# Altium schematic sheet Mainboard_LoRa   VCC  SCH.SchDoc
size A4
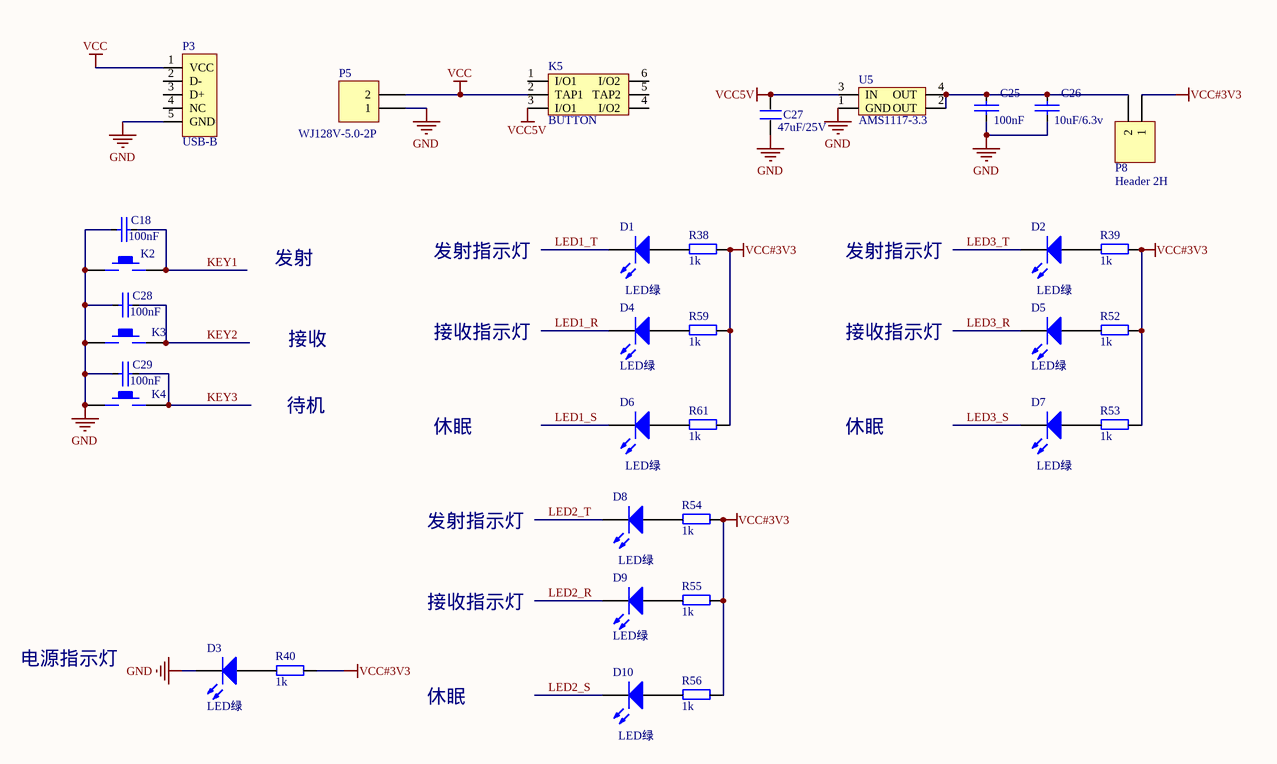
[diagram p0: Mainboard_LoRa   VCC  SCH.SchDoc]

## Parts
C18  100nF  [CAPC_0603_2]
C25  100nF  [CAPC_0603_2]
C26  10uF/6.3v  [CAPC_0603_2]
C27  47uF/25V  [CAPE_D]
C28  100nF  [CAPC_0603_2]
C29  100nF  [CAPC_0603_2]
D1  LED绿  [LED_0805_G]
D2  LED绿  [LED_0805_G]
D3  LED绿  [LED_0805_G]
D4  LED绿  [LED_0805_G]
D5  LED绿  [LED_0805_G]
D6  LED绿  [LED_0805_G]
D7  LED绿  [LED_0805_G]
D8  LED绿  [LED_0805_G]
D9  LED绿  [LED_0805_G]
D10  LED绿  [LED_0805_G]
K2  K2-1102SP-E4SC-04  [SW_PB_SMD_6X6]  (value not drawn)
K3  K2-1102SP-E4SC-04  [SW_PB_SMD_6X6]  (value not drawn)
K4  K2-1102SP-E4SC-04  [SW_PB_SMD_6X6]  (value not drawn)
K5  BUTTON  [KFT DIP-8X8]
P3  USB-B  [USB_Micro_DIP41]
P5  WJ128V-5.0-2P  [KF128_2P]
P8  Header 2H  [Header 2.54X2]
R38  1k  [RESC_0603_2]
R39  1k  [RESC_0603_2]
R40  1k  [RESC_0603_2]
R52  1k  [RESC_0603_2]
R53  1k  [RESC_0603_2]
R54  1k  [RESC_0603_2]
R55  1k  [RESC_0603_2]
R56  1k  [RESC_0603_2]
R59  1k  [RESC_0603_2]
R61  1k  [RESC_0603_2]
U5  AMS1117-3.3  [SOT223_3]

## Nets
GND: C18.1 C25.1 C26.1 C27.1 C28.1 C29.1 D3.2(K) K2.1 K3.1 K4.1 P3.5(GND) P5.1 U5.1(GND)
VCC: K5.2(TAP1) P3.1(VCC) P5.2
VCC5V: C27.2 K5.3(I/O1) U5.3(IN)
VCC#3V3: P8.1 R38.1 R39.1 R40.1 R52.1 R53.1 R54.1 R55.1 R56.1 R59.1 R61.1
KEY1: C18.2 K2.2
KEY2: C28.2 K3.2
KEY3: C29.2 K4.2
LED1_R: D4.2(K)
LED1_S: D6.2(K)
LED1_T: D1.2(K)
LED2_R: D9.2(K)
LED2_S: D10.2(K)
LED2_T: D8.2(K)
LED3_R: D5.2(K)
LED3_S: D7.2(K)
LED3_T: D2.2(K)
NetC25_2: C25.2 C26.2 P8.2 U5.2(OUT) U5.4(OUT)
NetD1_1: D1.1(A) R38.2
NetD2_1: D2.1(A) R39.2
NetD3_1: D3.1(A) R40.2
NetD4_1: D4.1(A) R59.2
NetD5_1: D5.1(A) R52.2
NetD6_1: D6.1(A) R61.2
NetD7_1: D7.1(A) R53.2
NetD8_1: D8.1(A) R54.2
NetD9_1: D9.1(A) R55.2
NetD10_1: D10.1(A) R56.2

Not connected (* = marked no-connect by the designer): K5 1(I/O1) 4(I/O2) 5(TAP2) 6(I/O2); P3 2(D-) 3(D+) 4(NC)

## Notes on the sheet
- 发射指示灯
- 发射
- 接收
- 接收指示灯
- 待机
- 休眠
- 电源指示灯
- 产品名称：
- 图纸编号：
- Size:
- Rev:
- Date:
- Sheet:

## Library data of the parts
C18 C25 C26 C28 C29 = C: 无极性电容
C27 = C
D1-D10 = LED2: Typical RED, GREEN, YELLOW, AMBER GaAs LED; Published: 8-Jun-2000; LatestRevisionDate: 17-Jul-2002; LatestRevisionNote: Re-released for DXP Platform.; PackageDocument: Feb-2002; PackageReference: 3.2X1.6X1.1; Publisher: Altium Limited
K2-K4 = KEY_M
P3 = USB5
P5 P8 = Header 2H: Header, 2-Pin, Right Angle; LatestRevisionDate: 17-Jul-2002; LatestRevisionNote: Re-released for DXP Platform.; Publisher: Altium Limited
R38-R40 R52-R56 R59 R61 = R
U5 = AMS1117